# EAGLE schematic measures_schematic_12-22 (EAGLE 9.6.2)

## Sheet 1 of 2
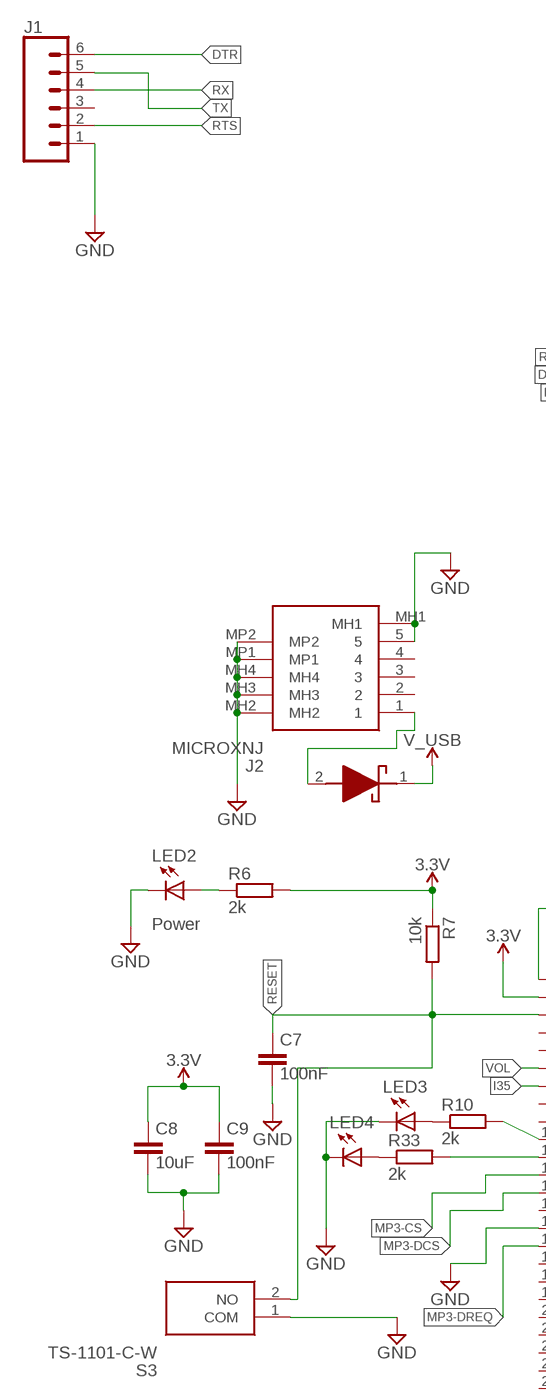
[diagram p0: schematic, sheet 1, part 1 of 2]
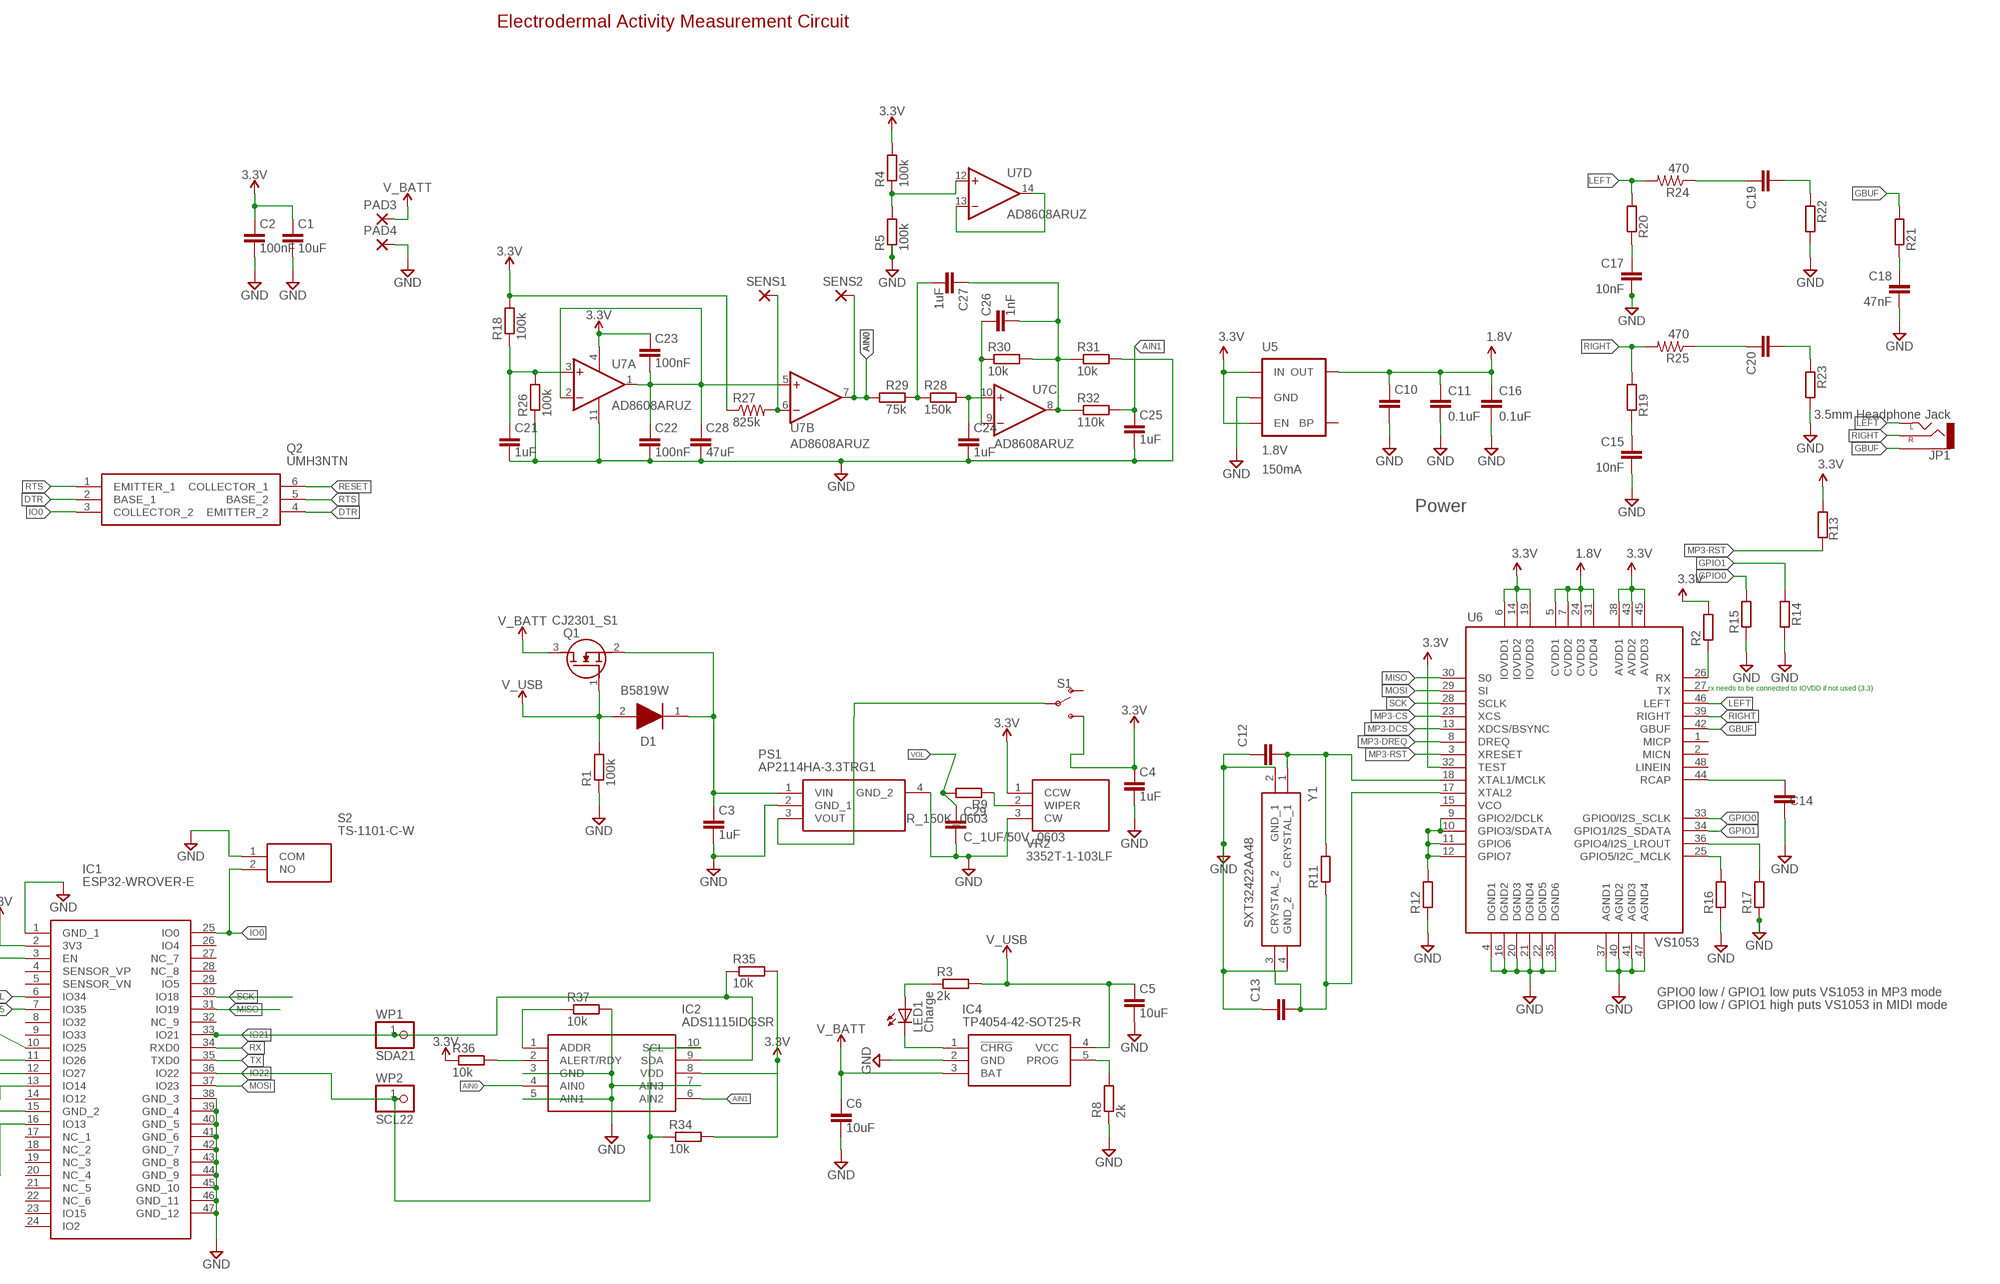
[diagram p1: schematic, sheet 1, part 2 of 2]

### Parts
C1  10uF  C_10UF/25V_0603  [C0603]
C2  100nF  C_100NF/50V_0603  [C0603]
C3  1uF  C_1UF/25V_0402  [C0402]
C4  1uF  C_1UF/25V_0402  [C0402]
C5  10uF  C_10UF/25V_0603  [C0603]
C6  10uF  C_10UF/25V_0603  [C0603]
C7  100nF  C_100NF/50V_0603  [C0603]
C8  10uF  C_10UF/25V_0603  [C0603]
C9  100nF  C_100NF/50V_0603  [C0603]
C10  10uF  C_10UF/25V_0603  [C0603]
C11  0.1uF  0.1UF-25V(+80/-20%)(0603)  [0603-CAP]
C12  22pF  C_12PF/50V_0603  [C0603]
C13  22pF  C_12PF/50V_0603  [C0603]
C14  1.0uF  C_1UF/25V_0402  [C0402]
C15  10nF  10NF/10000PF-50V-10%(0603)  [0603-CAP]
C16  0.1uF  0.1UF-25V(+80/-20%)(0603)  [0603-CAP]
C17  10nF  10NF/10000PF-50V-10%(0603)  [0603-CAP]
C18  47nF  47NF(0.047UF/47000PF)-25V-5%(0603)SMD  [0603-CAP]
C19  10uF  C_10UF/25V_0603  [C0603]
C20  10uF  C_10UF/25V_0603  [C0603]
C21  1uF  C_1UF/25V_0402  [C0402]
C22  100nF  C_100NF/50V_0603  [C0603]
C23  100nF  C_100NF/50V_0603  [C0603]
C24  1uF  C_1UF/50V_0603  [C0603]
C25  1uF  C_1UF/25V_0402  [C0402]
C26  1nF  C_1NF/50V_0603  [C0603]
C27  1uF  C_1UF/50V_0603  [C0603]
C28  47uF  C_47UF/10V_1206  [C1206]
C29  C_1UF/50V_0603  [C0603]
D1  B5819W  [SOD3716X125N]
D5  BAT760-7  [SOD2513X120N]
IC1  ESP32-WROVER-E  [ESP32WROVERE]
IC2  ADS1115IDGSR  [SOP50P490X110-10N]
IC4  TP4054-42-SOT25-R  [SOT95P280X100-5N]
J1  CONN_06NO_SILK_FEMALE_PTH  [1X06_NO_SILK]
J2  MICROXNJ  [MICROXNJ]
JP1  3.5mm Headphone Jack  AUDIO-JACKSMD2  [AUDIO-JACK-3.5MM-SMD]
LED1  Charge  LEDCHIP-LED0603  [CHIP-LED0603]
LED2  Power  LEDCHIP-LED0603  [CHIP-LED0603]
LED3  Power  LEDCHIP-LED0603  [CHIP-LED0603]
LED4  Power  LEDCHIP-LED0603  [CHIP-LED0603]
PAD3  2,54/0,8  [2,54/0,8]
PAD4  2,54/0,8  [2,54/0,8]
PS1  AP2114HA-3.3TRG1  [SOT230P700X180-4N]
Q1  CJ2301_S1  [SOT95P240X115-3N]
Q2  UMH3NTN  [UMH3NTN]
R1  100k  R_100K_0603  [R0603]
R2  100k  R_100K_0603  [R0603]
R3  2k  R_2K_0603  [R0603]
R4  100k  R_100K_0603  [R0603]
R5  100k  R_100K_0603  [R0603]
R6  2k  R_2K_0603  [R0603]
R7  10k  R_10K_0603  [R0603]
R8  2k  R_2K_0603  [R0603]
R9  R_150K_0603  [R0603]
R10  2k  R_2K_0603  [R0603]
R11  1M  R_1M_0603  [R0603]
R12  100k  R_100K_0603  [R0603]
R13  100k  R_100K_0603  [R0603]
R14  100k  R_100K_0603  [R0603]
R15  100k  R_100K_0603  [R0603]
R16  100k  R_100K_0603  [R0603]
R17  100k  R_100K_0603  [R0603]
R18  100k  R_100K_0603  [R0603]
R19  20  R_20R_0603  [R0603]
R20  20  R_20R_0603  [R0603]
R21  10  R_10R_0603  [R0603]
R22  10K  R_10K_0603  [R0603]
R23  10K  R_10K_0603  [R0603]
R24  470  470OHM1/10W1%(0603)  [0603-RES]
R25  470  470OHM1/10W1%(0603)  [0603-RES]
R26  100k  R_100K_0603  [R0603]
R27  825k  R-US_R0402  [R0402]
R28  150k  R_150K_0402  [R0402]
R29  75k  R_75K_0402  [R0402]
R30  10k  R_10K_0603  [R0603]
R31  10k  R_10K_0603  [R0603]
R32  110k  R_110K_0603  [R0603]
R33  2k  R_2K_0603  [R0603]
R34  10k  R_10K_0603  [R0603]
R35  10k  R_10K_0603  [R0603]
R36  10k  R_10K_0603  [R0603]
R37  10k  R_10K_0603  [R0603]
S1  SWITCH-SPDT-PTH-11.6X4.0MM  [SWITCH_SPDT_PTH_11.6X4.0MM]
S2  TS-1101-C-W  [TS1101CW]
S3  TS-1101-C-W  [TS1101CW]
SENS1  2,54/0,8  [2,54/0,8]
SENS2  2,54/0,8  [2,54/0,8]
U5  1.8V  V_REG_SP62141.8V  [SC70]
U6  VS1053  VS1033/1053SMD  [LQFP-48]
U7  AD8608ARUZ  [TSSOP14]
VR2  3352T-1-103LF  [3352T1103LF]
WP1  SDA21  WPAD-1-0805  [WPAD-1-0805]
WP2  SCL22  WPAD-1-0805  [WPAD-1-0805]
Y1  SXT32422AA48  [SXT32422AA48]

### Nets
1.8V: C10.1 C11.1 C16.1 U5.5(OUT) U6.5(CVDD1) U6.7(CVDD2) U6.24(CVDD3) U6.31(CVDD4)
3.3V: C1.1 C2.1 C4.1 C8.1 C9.1 C23.1 IC1.2(3V3) IC2.8(VDD) R2.2 R4.2 R6.2 R7.1 R13.2 R18.2 R27.1 R34.2 R35.2 R36.1 S1.3(S) U5.1(IN) U5.3(EN) U6.6(IOVDD1) U6.14(IOVDD2) U6.19(IOVDD3) U6.32(TEST) U6.38(AVDD1) U6.43(AVDD2) U6.45(AVDD3) U7.4(A:VCC) VR2.1(CCW)
AIN0: IC2.4(AIN0) R29.1 SENS2.1(P) U7.7(B:OUT)
AIN1: C25.1 IC2.6(AIN2) R32.2
DTR: J1.6 Q2.2(BASE_1) Q2.4(EMITTER_2)
G1: R12.2 U6.9(GPIO2/DCLK) U6.10(GPIO3/SDATA) U6.11(GPIO6) U6.12(GPIO7)
G2: R16.2 U6.25(GPIO5/I2C_MCLK)
GBUF: JP1.SLEEVE R21.2 U6.42(GBUF)
GND: C1.2 C2.2 C3.2 C4.2 C5.2 C6.2 C7.2 C8.2 C9.2 C10.2 C11.2 C12.1 C13.1 C14.1 C15.2 C16.2 C17.2 C18.2 C21.2 C22.2 C24.2 C25.2 C28.2 C29.2 IC1.1(GND_1) IC1.15(GND_2) IC1.38(GND_3) IC1.39(GND_4) IC1.40(GND_5) IC1.41(GND_6) IC1.42(GND_7) IC1.43(GND_8) IC1.44(GND_9) IC1.45(GND_10) IC1.46(GND_11) IC1.47(GND_12) IC2.3(GND) IC2.5(AIN1) IC2.7(AIN3) IC4.2(GND) J1.1 J2.5 J2.MH1 J2.MH2 J2.MH3 J2.MH4 J2.MP1 J2.MP2 LED2.C LED3.C LED4.C PAD4.1(P) PS1.2(GND_1) PS1.4(GND_2) R1.1 R5.1 R8.1 R12.1 R14.1 R15.1 R16.1 R17.1 R22.2 R23.2 R26.1 R31.2 R37.2 S2.1(COM) S3.1(COM) U5.2(GND) U6.4(DGND1) U6.16(DGND2) U6.20(DGND3) U6.21(DGND4) U6.22(DGND5) U6.35(DGND6) U6.37(AGND1) U6.40(AGND2) U6.41(AGND3) U6.47(AGND4) U7.11(A:GND) VR2.3(CW) Y1.2(GND_1) Y1.4(GND_2)
GPIO0: R15.2 U6.33(GPIO0/I2S_SCLK)
GPIO1: R14.2 U6.34(GPIO1/I2S_SDATA)
GPIO4: R17.2 U6.36(GPIO4/I2S_LROUT)
I35: IC1.7(IO35)
IO0: IC1.25(IO0) Q2.3(COLLECTOR_2) S2.2(NO)
IO21: IC1.33(IO21) IC2.9(SDA) R35.1 WP1.1
IO22: IC1.36(IO22) IC2.10(SCL) R34.1 WP2.1
LEFT: JP1.TIP(LEFT) R20.2 R24.2 U6.46(LEFT)
MIDI-RX: R2.1 U6.26(RX)
MISO: IC1.31(IO19) U6.30(S0)
MOSI: IC1.37(IO23) U6.29(SI)
MP3-CS: IC1.12(IO27) U6.23(XCS)
MP3-DCS: IC1.13(IO14) U6.13(XDCS/BSYNC)
MP3-DREQ: IC1.16(IO13) U6.8(DREQ)
MP3-RST: R13.1 U6.3(XRESET)
N$1: PS1.3(VOUT) S1.2(P)
N$2: C3.1 D1.1(K) PS1.1(VIN) Q1.2(S)
N$3: LED2.A R6.1
N$4: IC4.1(!CHRG) LED1.C
N$5: LED1.A R3.1
N$6: D5.2(A) J2.1
N$7: IC4.5(PROG) R8.2
N$8: R9.1 VR2.2(WIPER)
N$9: R4.1 R5.2 U7.12(D:+IN)
N$10: U7.13(D:-IN) U7.14(D:OUT)
N$11: IC1.10(IO25) R10.2
N$12: IC1.11(IO26) R33.2
N$13: C12.2 R11.2 U6.18(XTAL1/MCLK) Y1.1(CRYSTAL_1)
N$14: C13.2 R11.1 U6.17(XTAL2) Y1.3(CRYSTAL_2)
N$15: C18.1 R21.1
N$16: C17.1 R20.1
N$17: C15.1 R19.1
N$18: C20.1 R25.1
N$19: C19.1 R24.1
N$20: C21.1 R18.1 R26.2 U7.3(A:+IN)
N$21: C22.1 C23.2 C28.1 U7.1(A:OUT) U7.2(A:-IN) U7.5(B:+IN)
N$22: R27.2 SENS1.1(P) U7.6(B:-IN)
N$23: C24.1 R28.2 U7.10(C:+IN)
N$24: C26.2 C27.1 R30.2 R31.1 R32.1 U7.8(C:OUT)
N$25: C26.1 R30.1 U7.9(C:-IN)
N$26: C27.2 R28.1 R29.2
N$27: LED3.A R10.1
N$28: LED4.A R33.1
N$29: IC2.2(ALERT/RDY) R36.2
N$30: IC2.1(ADDR) R37.1
RCAP: C14.2 U6.44(RCAP)
RESET: C7.1 IC1.3(EN) Q2.6(COLLECTOR_1) R7.2 S3.2(NO)
RIGHT: JP1.RING(RIGHT) R19.2 R25.2 U6.39(RIGHT)
RTS: J1.2 Q2.1(EMITTER_1) Q2.5(BASE_2)
RX: IC1.34(RXD0) J1.4
SCK: IC1.30(IO18) U6.28(SCLK)
SPKR-L: C19.2 R22.1
SPKR-R: C20.2 R23.1
TX: IC1.35(TXD0) J1.5
V_BATT: C6.1 IC4.3(BAT) PAD3.1(P) Q1.3(D)
V_USB: C5.1 D1.2(A) D5.1(K) IC4.4(VCC) Q1.1(G) R1.2 R3.2
VOL: C29.1 IC1.6(IO34) R9.2
Unconnected: IC1.4(SENSOR_VP) IC1.5(SENSOR_VN) IC1.8(IO32) IC1.9(IO33) IC1.14(IO12) IC1.17(NC_1) IC1.18(NC_2) IC1.19(NC_3) IC1.20(NC_4) IC1.21(NC_5) IC1.22(NC_6) IC1.23(IO15) IC1.24(IO2) IC1.26(IO4) IC1.27(NC_7) IC1.28(NC_8) IC1.29(IO5) IC1.32(NC_9) J1.3 J2.2 J2.3 J2.4 S1.1(O) U5.4(BP) U6.1(MICP) U6.2(MICN) U6.15(VCO) U6.27(TX) U6.48(LINEIN)

### Notes on the sheet
- Electrodermal Activity Measurement Circuit
- 150mA
- Power
- rx needs to be connected to IOVDD if not used (3.3)
- GPIO0 low / GPIO1 low puts VS1053 in MP3 mode
- GPIO0 low / GPIO1 high puts VS1053 in MIDI mode

## Sheet 2 of 2

## Library data of the parts
C1 C5 C6 C8 C10 C19 C20 = JLC PCB Basic Parts_loc:C_: Capacitor General purpose SMD Capacitor; LCSC_DATASHEET: https://datasheet.lcsc.com/lcsc/1811110921_Samsung-Electro-Mechanics-CL10A106MA8NRNC_C96446.pdf; LCSC_PART: C96446; LCSC_ROTATION_CCW: 0; LCSC_STOCK: 119091; PROPERTIES: X5R 25V ±20% 10uF 0603 ROHS
C2 C7 C9 C22 C23 = JLC PCB Basic Parts_loc:C_: Capacitor General purpose SMD Capacitor; LCSC_DATASHEET: https://datasheet.lcsc.com/lcsc/1809301912_YAGEO-CC0603KRX7R9BB104_C14663.pdf; LCSC_PART: C14663; LCSC_ROTATION_CCW: 0; LCSC_STOCK: 7111530; PROPERTIES: 50V 100nF X7R ±10% 0603 ROHS
C3 C4 C14 C21 C25 = JLC PCB Basic Parts_loc:C_: Capacitor General purpose SMD Capacitor; LCSC_DATASHEET: https://datasheet.lcsc.com/lcsc/1811091611_Samsung-Electro-Mechanics-CL05A105KA5NQNC_C52923.pdf; LCSC_PART: C52923; LCSC_ROTATION_CCW: 0; LCSC_STOCK: 6404174; PROPERTIES: 25V 1uF X5R ±10% 0402 ROHS
C11 C16 = SparkFun-Capacitors:0.1UF-25V(+80/-20%)(0603): CAP-00810 Ceramic Standard decoupling cap; PROD_ID: CAP-00810
C12 C13 = JLC PCB Basic Parts_loc:C_: Capacitor General purpose SMD Capacitor; LCSC_DATASHEET: https://datasheet.lcsc.com/lcsc/1810261515_Samsung-Electro-Mechanics-CL10C120JB8NNNC_C38523.pdf; LCSC_PART: C38523; LCSC_ROTATION_CCW: 0; LCSC_STOCK: 87030; PROPERTIES: 50V 12pF C0G ±5% 0603 ROHS
C15 C17 = SparkFun-Capacitors:10NF/10000PF-50V-10%(0603): CAP-00867; PROD_ID: CAP-00867
C18 = SparkFun-Capacitors:47NF(0.047UF/47000PF)-25V-5%(0603): CAP-08605; PROD_ID: CAP-08605
C24 C27 C29 = JLC PCB Basic Parts_loc:C_: Capacitor General purpose SMD Capacitor; LCSC_DATASHEET: https://datasheet.lcsc.com/lcsc/1810261812_Samsung-Electro-Mechanics-CL10A105KB8NNNC_C15849.pdf; LCSC_PART: C15849; LCSC_ROTATION_CCW: 0; LCSC_STOCK: 14650365; PROPERTIES: 50V 1uF X5R ±10% 0603 ROHS
C26 = JLC PCB Basic Parts_loc:C_: Capacitor General purpose SMD Capacitor; LCSC_DATASHEET: https://datasheet.lcsc.com/lcsc/1811071810_Samsung-Electro-Mechanics-CL10B102KB8NNNC_C1588.pdf; LCSC_PART: C1588; LCSC_ROTATION_CCW: 0; LCSC_STOCK: 2243141; PROPERTIES: 50V 1nF X7R ±10% 0603 ROHS
C28 = JLC PCB Basic Parts_loc:C_: Capacitor General purpose SMD Capacitor; LCSC_DATASHEET: https://datasheet.lcsc.com/lcsc/1810221121_Samsung-Electro-Mechanics-CL31A476MPHNNNE_C96123.pdf; LCSC_PART: C96123; LCSC_ROTATION_CCW: 0; LCSC_STOCK: 279828; PROPERTIES: 10V 47uF X5R ±20% 1206 ROHS
D1 = B5819W:B5819W: 40V 1A 600mV @ 1A SOD-123 Schottky Barrier Diodes (SBD) Source: Datasheet <https://datasheet.lcsc.com/szlcsc/Changjiang-Electronics-Tech-CJ-B5819W_C8598.pdf>; DESCRIPTION: 40V 1A 600mV @ 1A SOD-123 Schottky Barrier Diodes (SBD); HEIGHT: 1.25mm; MANUFACTURER_NAME: Changjiang Electronics Tech (CJ); MANUFACTURER_PART_NUMBER: B5819W
D5 = BAT760-7:BAT760-7: Diode Schottky 30V 1A 2Pin SOD323 Diodes Inc BAT760-7, SMT Schottky Diode, 30V 1A, 2-Pin SOD-323 Source: Datasheet <https://www.diodes.com/assets/Datasheets/ds30498.pdf>; ARROW_PART_NUMBER: BAT760-7; ARROW_PRICE-STOCK: https://www.arrow.com/en/products/bat760-7/diodes-incorporated?region=europe; DESCRIPTION: Diode Schottky 30V 1A 2Pin SOD323 Diodes Inc BAT760-7, SMT Schottky Diode, 30V 1A, 2-Pin SOD-323; HEIGHT: 1.2mm; MANUFACTURER_NAME: Diodes Inc.; MANUFACTURER_PART_NUMBER: BAT760-7; MOUSER_PART_NUMBER: 621-BAT760-7; MOUSER_PRICE-STOCK: https://www.mouser.co.uk/ProductDetail/Diodes-Incorporated/BAT760-7?qs=JV7lzlMm3yKDDyO09xoRbQ%3D%3D
IC1 = ESP32-WROVER-E:ESP32-WROVER-E: Module: IoT; Bluetooth Low Energy,WiFi; PCB; SMD; 18x31.4x3.3mm Source: Datasheet; DESCRIPTION: Module: IoT; Bluetooth Low Energy,WiFi; PCB; SMD; 18x31.4x3.3mm; HEIGHT: 3.45mm; MANUFACTURER_NAME: Espressif Systems; MANUFACTURER_PART_NUMBER: ESP32-WROVER-E
IC2 = ADS1115IDGSR:ADS1115IDGSR: 16-Bit 860SPS 4-Ch Delta-Sigma ADC With PGA, Oscillator, Vref, Comparator, and I2C Source: Datasheet <http://www.ti.com/lit/gpn/ADS1115>; ARROW_PART_NUMBER: ADS1115IDGSR; ARROW_PRICE-STOCK: https://www.arrow.com/en/products/ads1115idgsr/texas-instruments?region=nac; DESCRIPTION: 16-Bit 860SPS 4-Ch Delta-Sigma ADC With PGA, Oscillator, Vref, Comparator, and I2C; HEIGHT: 1.1mm; MANUFACTURER_NAME: Texas Instruments; MANUFACTURER_PART_NUMBER: ADS1115IDGSR; MOUSER_PART_NUMBER: 595-ADS1115IDGSR; MOUSER_PRICE-STOCK: https://www.mouser.co.uk/ProductDetail/Texas-Instruments/ADS1115IDGSR?qs=IK5e5L0zOXjKCJoVMhYO%2FQ%3D%3D
IC4 = TP4054-42-SOT25-R:TP4054-42-SOT25-R: Standalone Linear Li-ion Battery Charger with Thermal Regulation, SOT-23-5 Source: Datasheet <http://images.100y.com.tw/pdf_file/38-TP-TP4054x.pdf>; DESCRIPTION: Standalone Linear Li-ion Battery Charger with Thermal Regulation, SOT-23-5; HEIGHT: 1mm; MANUFACTURER_NAME: TOP POWER; MANUFACTURER_PART_NUMBER: TP4054-42-SOT25-R
J1 = SparkFun-Connectors:CONN_06: Multi connection point. Often used as Generic Header-pin footprint for 0.1 inch spaced/style header connections On any of the 0.1 inch spaced packages, you can populate with these: Break Away Headers - Straight <https://www.sparkfun.com/products/116> (PRT-00116) Break Away Male Headers - Right Angle <https://www.sparkfun.com/products/553> (PRT-00553) Female Headers <https://www.sparkfun.com/products/115> (PRT-00115) Break Away Headers - Machine Pin <https://www.sparkfun.com/products/117> (PRT-00117) Break Away Female Headers - Swiss Machine Pin <https://www.sparkfun.com/products/743> (PRT-00743) Arduino Stackable Header - 6 Pin <https://www.sparkfun.com/products/9280> (PRT-09280) For SCREWTERMINALS and SPRING TERMINALS visit here: Screw Terimnals on SparkFun.com <https://www.sparkfun.com/search/results?term=Screw+Terminals> (5mm/3.5mm/2.54mm spacing) This device is also useful as a general connection point to wire up your design to another part of your project. Our various solder wires solder well into these plated through hole pads. Hook-Up Wire - Assortment (Stranded, 22 AWG) <https://www.sparkfun.com/products/11375> (PRT-11375) Hook-Up Wire - Assortment (Solid Core, 22 AWG) <https://www.sparkfun.com/products/11367> (PRT-11367) View the entire wire category on our website here <https://www.sparkfun.com/categories/141>; PROD_ID: CONN-08437
J2 = MICROXNJ:MICROXNJ: MICRO-USB-SMD_MICROXNJ Source: Datasheet <https://datasheet.lcsc.com/szlcsc/1912111437_SHOU-HAN-MicroXNJ_C404969.pdf>; DESCRIPTION: MICRO-USB-SMD_MICROXNJ; HEIGHT: 2.425mm; MANUFACTURER_NAME: Shou Han; MANUFACTURER_PART_NUMBER: MICROXNJ
JP1 = SparkFun-Connectors:AUDIO-JACK: 3.5mm Audio Jack Simple 3.5mm common PCB mount audio jack. SKU: PRT-08032; PROD_ID: CONN-10353
LED1-LED4 = adafruit:LED: LED OSRAM: - CHIPLED LG R971, LG N971, LY N971, LG Q971, LY Q971, LO R971, LY R971 LH N974, LH R974 LS Q976, LO Q976, LY Q976 LO Q996 - Hyper CHIPLED LW Q18S LB Q993, LB Q99A, LB R99A - SideLED LS A670, LO A670, LY A670, LG A670, LP A670 LB A673, LV A673, LT A673, LW A673 LH A674 LY A675 LS A676, LA A676, LO A676, LY A676, LW A676 LS A679, LY A679, LG A679 - Hyper Micro SIDELED® LS Y876, LA Y876, LO Y876, LY Y876 LT Y87S - SmartLED LW L88C, LW L88S LB L89C, LB L89S, LG L890 LS L89K, LO L89K, LY L89K LS L896, LA L896, LO L896, LY L896 - TOPLED LS T670, LO T670, LY T670, LG T670, LP T670 LSG T670, LSP T670, LSY T670, LOP T670, LYG T670 LG T671, LOG T671, LSG T671 LB T673, LV T673, LT T673, LW T673 LH T674 LS T676, LA T676, LO T676, LY T676, LB T676, LH T676, LSB T676, LW T676 LB T67C, LV T67C, LT T67C, LS T67K, LO T67K, LY T67K, LW E67C LS E67B, LA E67B, LO E67B, LY E67B, LB E67C, LV E67C, LT E67C LW T67C LS T679, LY T679, LG T679 LS T770, LO T770, LY T770, LG T770, LP T770 LB T773, LV T773, LT T773, LW T773 LH T774 LS E675, LA E675, LY E675, LS T675 LS T776, LA T776, LO T776, LY T776, LB T776 LHGB T686 LT T68C, LB T68C - Hyper Mini TOPLED® LB M676 - Mini TOPLED Santana® LG M470 LS M47K, LO M47K, LY M47K Source: http://www.osram.convergy.de/
PAD3 PAD4 SENS1 SENS2 = wirepad:2,54/0,8: THROUGH-HOLE PAD
PS1 = AP2114HA-3.3TRG1:AP2114HA-3.3TRG1: LDO Voltage Regulators 1A LN CMOS LDO 0.45V 60uA 50mA Source: Datasheet <https://mouser.componentsearchengine.com/Datasheets/1/AP2114HA-3.3TRG1.pdf>; ARROW_PART_NUMBER: AP2114HA-3.3TRG1; ARROW_PRICE-STOCK: https://www.arrow.com/en/products/ap2114ha-3.3trg1/diodes-incorporated; DESCRIPTION: LDO Voltage Regulators 1A LN CMOS LDO 0.45V 60uA 50mA; HEIGHT: 1.8mm; MANUFACTURER_NAME: Diodes Inc.; MANUFACTURER_PART_NUMBER: AP2114HA-3.3TRG1; MOUSER_PART_NUMBER: 621-AP2114HA-3.3TRG1; MOUSER_PRICE-STOCK: https://www.mouser.co.uk/ProductDetail/Diodes-Incorporated/AP2114HA-33TRG1?qs=M%2FOdCRO8QQ3KWhA9Gt6VoQ%3D%3D
Q1 = CJ2301_S1:CJ2301_S1: MOSFET P Trench 20V 2.3A 1V @ 250uA 112 m @ 2.8A,4.5V SOT-23(SOT-23-3) RoHS Source: Datasheet <https://datasheet.lcsc.com/szlcsc/Changjiang-Electronics-Tech-CJ-CJ2301-S1_C8547.pdf>; DESCRIPTION: MOSFET P Trench 20V 2.3A 1V @ 250uA 112 m @ 2.8A,4.5V SOT-23(SOT-23-3) RoHS; HEIGHT: 1.15mm; MANUFACTURER_NAME: Changjiang Electronics Tech (CJ); MANUFACTURER_PART_NUMBER: CJ2301 S1
Q2 = UMH3NTN:UMH3NTN: Bipolar Transistors - Pre-Biased DUAL NPN 50V 100MA SOT-363 Source: Datasheet <https://componentsearchengine.com/Datasheets/2/UMH3NTN.pdf>; ARROW_PART_NUMBER: UMH3NTN; ARROW_PRICE-STOCK: https://www.arrow.com/en/products/umh3ntn/rohm-semiconductor?region=nac; DESCRIPTION: Bipolar Transistors - Pre-Biased DUAL NPN 50V 100MA SOT-363; HEIGHT: 1mm; MANUFACTURER_NAME: ROHM Semiconductor; MANUFACTURER_PART_NUMBER: UMH3NTN; MOUSER_PART_NUMBER: 755-UMH3NTN; MOUSER_PRICE-STOCK: https://www.mouser.co.uk/ProductDetail/ROHM-Semiconductor/UMH3NTN?qs=4kLU8WoGk0st6ahJ6z2bmw%3D%3D
R1 R2 R4 R5 R12-R18 R26 = JLC PCB Basic Parts_loc:R_: Resistor General purpose SMD Resistor; LCSC_DATASHEET: https://datasheet.lcsc.com/lcsc/2110260030_UNI-ROYAL-Uniroyal-Elec-0603WAF1003T5E_C25803.pdf; LCSC_PART: C25803; LCSC_ROTATION_CCW: 0; LCSC_STOCK: 5826279; PROPERTIES: ±1% 1/10W Thick Film Resistors 75V ±100ppm -55°C~+155°C 100kOhm 0603 ROHS
R3 R6 R8 R10 R33 = JLC PCB Basic Parts_loc:R_: Resistor General purpose SMD Resistor; LCSC_DATASHEET: https://datasheet.lcsc.com/lcsc/2110252130_UNI-ROYAL-Uniroyal-Elec-0603WAF2001T5E_C22975.pdf; LCSC_PART: C22975; LCSC_ROTATION_CCW: 0; LCSC_STOCK: 3372290; PROPERTIES: ±1% 1/10W Thick Film Resistors 75V ±100ppm -55°C~+155°C 2kOhm 0603 ROHS
R7 R22 R23 R30 R31 R34-R37 = JLC PCB Basic Parts_loc:R_: Resistor General purpose SMD Resistor; LCSC_DATASHEET: https://datasheet.lcsc.com/lcsc/2110260030_UNI-ROYAL-Uniroyal-Elec-0603WAF1002T5E_C25804.pdf; LCSC_PART: C25804; LCSC_ROTATION_CCW: 0; LCSC_STOCK: 7979018; PROPERTIES: ±1% 1/10W Thick Film Resistors 75V ±100ppm -55°C~+155°C 10kOhm 0603 ROHS
R9 = JLC PCB Basic Parts_loc:R_: Resistor General purpose SMD Resistor; LCSC_DATASHEET: https://datasheet.lcsc.com/lcsc/2110252030_UNI-ROYAL-Uniroyal-Elec-0603WAF1503T5E_C22807.pdf; LCSC_PART: C22807; LCSC_ROTATION_CCW: 0; LCSC_STOCK: 285183; PROPERTIES: ±1% 1/10W Thick Film Resistors 75V ±100ppm -55°C~+155°C 150kOhm 0603 ROHS
R11 = JLC PCB Basic Parts_loc:R_: Resistor General purpose SMD Resistor; LCSC_DATASHEET: https://datasheet.lcsc.com/lcsc/2110252030_UNI-ROYAL-Uniroyal-Elec-0603WAF1004T5E_C22935.pdf; LCSC_PART: C22935; LCSC_ROTATION_CCW: 0; LCSC_STOCK: 1411723; PROPERTIES: ±1% 1/10W Thick Film Resistors 75V ±100ppm -55°C~+155°C 1MOhm 0603 ROHS
R19 R20 = JLC PCB Basic Parts_loc:R_: Resistor General purpose SMD Resistor; LCSC_DATASHEET: https://datasheet.lcsc.com/lcsc/2110252030_UNI-ROYAL-Uniroyal-Elec-0603WAF200JT5E_C22950.pdf; LCSC_PART: C22950; LCSC_ROTATION_CCW: 0; LCSC_STOCK: 40713; PROPERTIES: ±1% 1/10W Thick Film Resistors 75V ±100ppm -55°C~+155°C 20Ohm 0603 ROHS
R21 = JLC PCB Basic Parts_loc:R_: Resistor General purpose SMD Resistor; LCSC_DATASHEET: https://datasheet.lcsc.com/lcsc/2110252030_UNI-ROYAL-Uniroyal-Elec-0603WAF100JT5E_C22859.pdf; LCSC_PART: C22859; LCSC_ROTATION_CCW: 0; LCSC_STOCK: 2733989; PROPERTIES: ±1% 1/10W Thick Film Resistors 75V ±400ppm -55°C~+155°C 10Ohm 0603 ROHS
R24 R25 = SparkFun-Resistors:470OHM1/10W1%(0603): RES-07869; PROD_ID: RES-07869
R27 = adafruit:R-US_: RESISTOR, American symbol
R28 = JLC PCB Basic Parts_loc:R_: Resistor General purpose SMD Resistor; LCSC_DATASHEET: https://datasheet.lcsc.com/lcsc/2110260030_UNI-ROYAL-Uniroyal-Elec-0402WGF1503TCE_C25755.pdf; LCSC_PART: C25755; LCSC_ROTATION_CCW: 0; LCSC_STOCK: 128267; PROPERTIES: ±1% 1/16W Thick Film Resistors 50V ±100ppm -55°C~+155°C 150kOhm 0402 ROHS
R29 = JLC PCB Basic Parts_loc:R_: Resistor General purpose SMD Resistor; LCSC_DATASHEET: https://datasheet.lcsc.com/lcsc/2110260030_UNI-ROYAL-Uniroyal-Elec-0402WGF7502TCE_C25798.pdf; LCSC_PART: C25798; LCSC_ROTATION_CCW: 0; LCSC_STOCK: 100400; PROPERTIES: ±1% 1/16W Thick Film Resistors 50V ±100ppm -55°C~+155°C 75kOhm 0402 ROHS
R32 = JLC PCB Basic Parts_loc:R_: Resistor General purpose SMD Resistor; LCSC_DATASHEET: https://datasheet.lcsc.com/lcsc/2110260030_UNI-ROYAL-Uniroyal-Elec-0603WAF1103T5E_C25805.pdf; LCSC_PART: C25805; LCSC_ROTATION_CCW: 0; LCSC_STOCK: 86411; PROPERTIES: ±1% 1/10W Thick Film Resistors 75V ±100ppm -55°C~+155°C 110kOhm 0603 ROHS
S1 = SparkFun-Switches:SWITCH-SPDT: Single Pole, Double Throw (SPDT) Switch Single-pole, double-throw (SPDT) switch. Variant Overview SMD-AYZ0202 Surface Mount DPDT Switch <https://www.sparkfun.com/products/597> (COM-00597) Used on e.g. LilyPad Arduino USB - ATmega32U4 Board <https://www.sparkfun.com/products/12049> PTH-11.6X4.0MM SPDT Mini Power Switch <https://www.sparkfun.com/products/102> (COM-00102) Used on e.g. SparkFun Simon Says - Through-Hole Soldering Kit <https://www.sparkfun.com/products/10547> (KIT-10547) PTH-11.6X4.0MM-KIT KIT version of SPDT Mini Power Switch - Simplifies soldering by removing tStop of switch pins - only one side can be soldered. PTH-11.6X4.0MM-LOCK LOCK version of SPDT Mini Power Switch - Offset pins hold switch in place for easier soldering. SMD-RIGHT-ANGLE Surface Mount Right Angle Switch <https://www.sparkfun.com/products/10860> (COM-10860) Used on e.g. SparkFun ESP8266 Thing <https://www.sparkfun.com/products/13231>; PROD_ID: SWCH-08261; SF_SKU: COM-00102
S2 S3 = TS-1101-C-W:TS-1101-C-W: tact switch 3x6x2.5 stick flat foot white button 260GF Source: Datasheet <http://www.helloxkb.com/public/images/pdf/TS-1101-X-X.pdf>; DESCRIPTION: tact switch 3x6x2.5 stick flat foot white button 260GF; HEIGHT: 2.6mm; MANUFACTURER_NAME: XKB Connectivity; MANUFACTURER_PART_NUMBER: TS-1101-C-W
U5 = SparkFun-PowerIC:V_REG_SP6214; PROD_ID: VREG-08428; VALUE: 1.8V/100mA
U6 = SparkFun-DigitalIC:VS1033/1053: MP3 codec; PROD_ID: IC-08983; VALUE: VS1053B
U7 = AD8608ARUZ:AD8608ARUZ: Quad Op-Amp, single supply, rail to rail, low noise Check prices <https://pricing.snapeda.com/parts/AD8608ARUZ/Analog%20Devices/view-part?ref=eda>; AVAILABILITY: In Stock; DESCRIPTION: CMOS Amplifier 4 Circuit Rail-to-Rail 14-TSSOP; MF: Analog Devices; MP: AD8608ARUZ; PACKAGE: TSSOP-14 Analog Devices; PRICE: None
VR2 = 3352T-1-103LF:3352T-1-103LF: Trimmer Resistors - Through Hole Source: Datasheet <https://www.bourns.com/docs/Product-Datasheets/3352.pdf>; ARROW_PART_NUMBER: 3352T-1-103LF; ARROW_PRICE-STOCK: https://www.arrow.com/en/products/3352t-1-103lf/bourns; DESCRIPTION: Trimmer Resistors - Through Hole; HEIGHT: 5.33mm; MANUFACTURER_NAME: Bourns; MANUFACTURER_PART_NUMBER: 3352T-1-103LF; MOUSER_PART_NUMBER: 652-3352T-1-103LF; MOUSER_PRICE-STOCK: https://www.mouser.co.uk/ProductDetail/Bourns/3352T-1-103LF?qs=EYTJzGwugUoW6t2SAeQ12A%3D%3D
WP1 WP2 = PatternAgents-ProtoPads:WPAD-1: Wire Pad - Single Good for scope lead clips, test jumpers, probe points, etc. PatternAgents ProtoPads Library Schematic and PCB layout libraries for design patterns by PatternAgents. For the CADSoft Eagle CAD program : http://www.cadsoftusa.com/download-eagle/ Source LBR : http://www.patternagents.com Github : https://github.com/PatternAgents License : http://creativecommons.org/licenses/by-sa/4.0/ (Creative Commons 4.0) THIS SOFTWARE IS PROVIDED BY THE CONTRIBUTORS "AS IS" AND WITHOUT ANY EXPRESS OR IMPLIED WARRANTIES, INCLUDING, BUT NOT LIMITED TO, THE IMPLIED WARRANTIES OF MERCHANTABILITY AND FITNESS FOR A PARTICULAR PURPOSE ARE DISCLAIMED. IN NO EVENT SHALL THE COPYRIGHT OWNER OR CONTRIBUTORS BE LIABLE FOR ANY DIRECT, INDIRECT, INCIDENTAL, SPECIAL, EXEMPLARY, OR CONSEQUENTIAL DAMAGES (INCLUDING, BUT NOT LIMITED TO, PROCUREMENT OF SUBSTITUTE GOODS OR SERVICES; LOSS OF USE, DATA, OR PROFITS; OR BUSINESS INTERRUPTION) HOWEVER CAUSED AND ON ANY THEORY OF LIABILITY, WHETHER IN CONTRACT, STRICT LIABILITY, OR TORT (INCLUDING NEGLIGENCE OR OTHERWISE) ARISING IN ANY WAY OUT OF THE USE OF THIS SOFTWARE, EVEN IF ADVISED OF THE POSSIBILITY OF SUCH DAMAGE.; BOM: EXCLUDE
Y1 = SXT32422AA48:SXT32422AA48: 32MHz +/-50ppm Crystal 22pF 40 Ohms 4-SMD, No Lead Source: Datasheet <https://suntsu.com/wp-content/uploads/2020/07/SXT324-Series-1.pdf>; DESCRIPTION: 32MHz +/-50ppm Crystal 22pF 40 Ohms 4-SMD, No Lead; HEIGHT: 0.8mm; MANUFACTURER_NAME: Suntsu; MANUFACTURER_PART_NUMBER: SXT32422AA48